# EasyEDA schematic EasyEDA.json
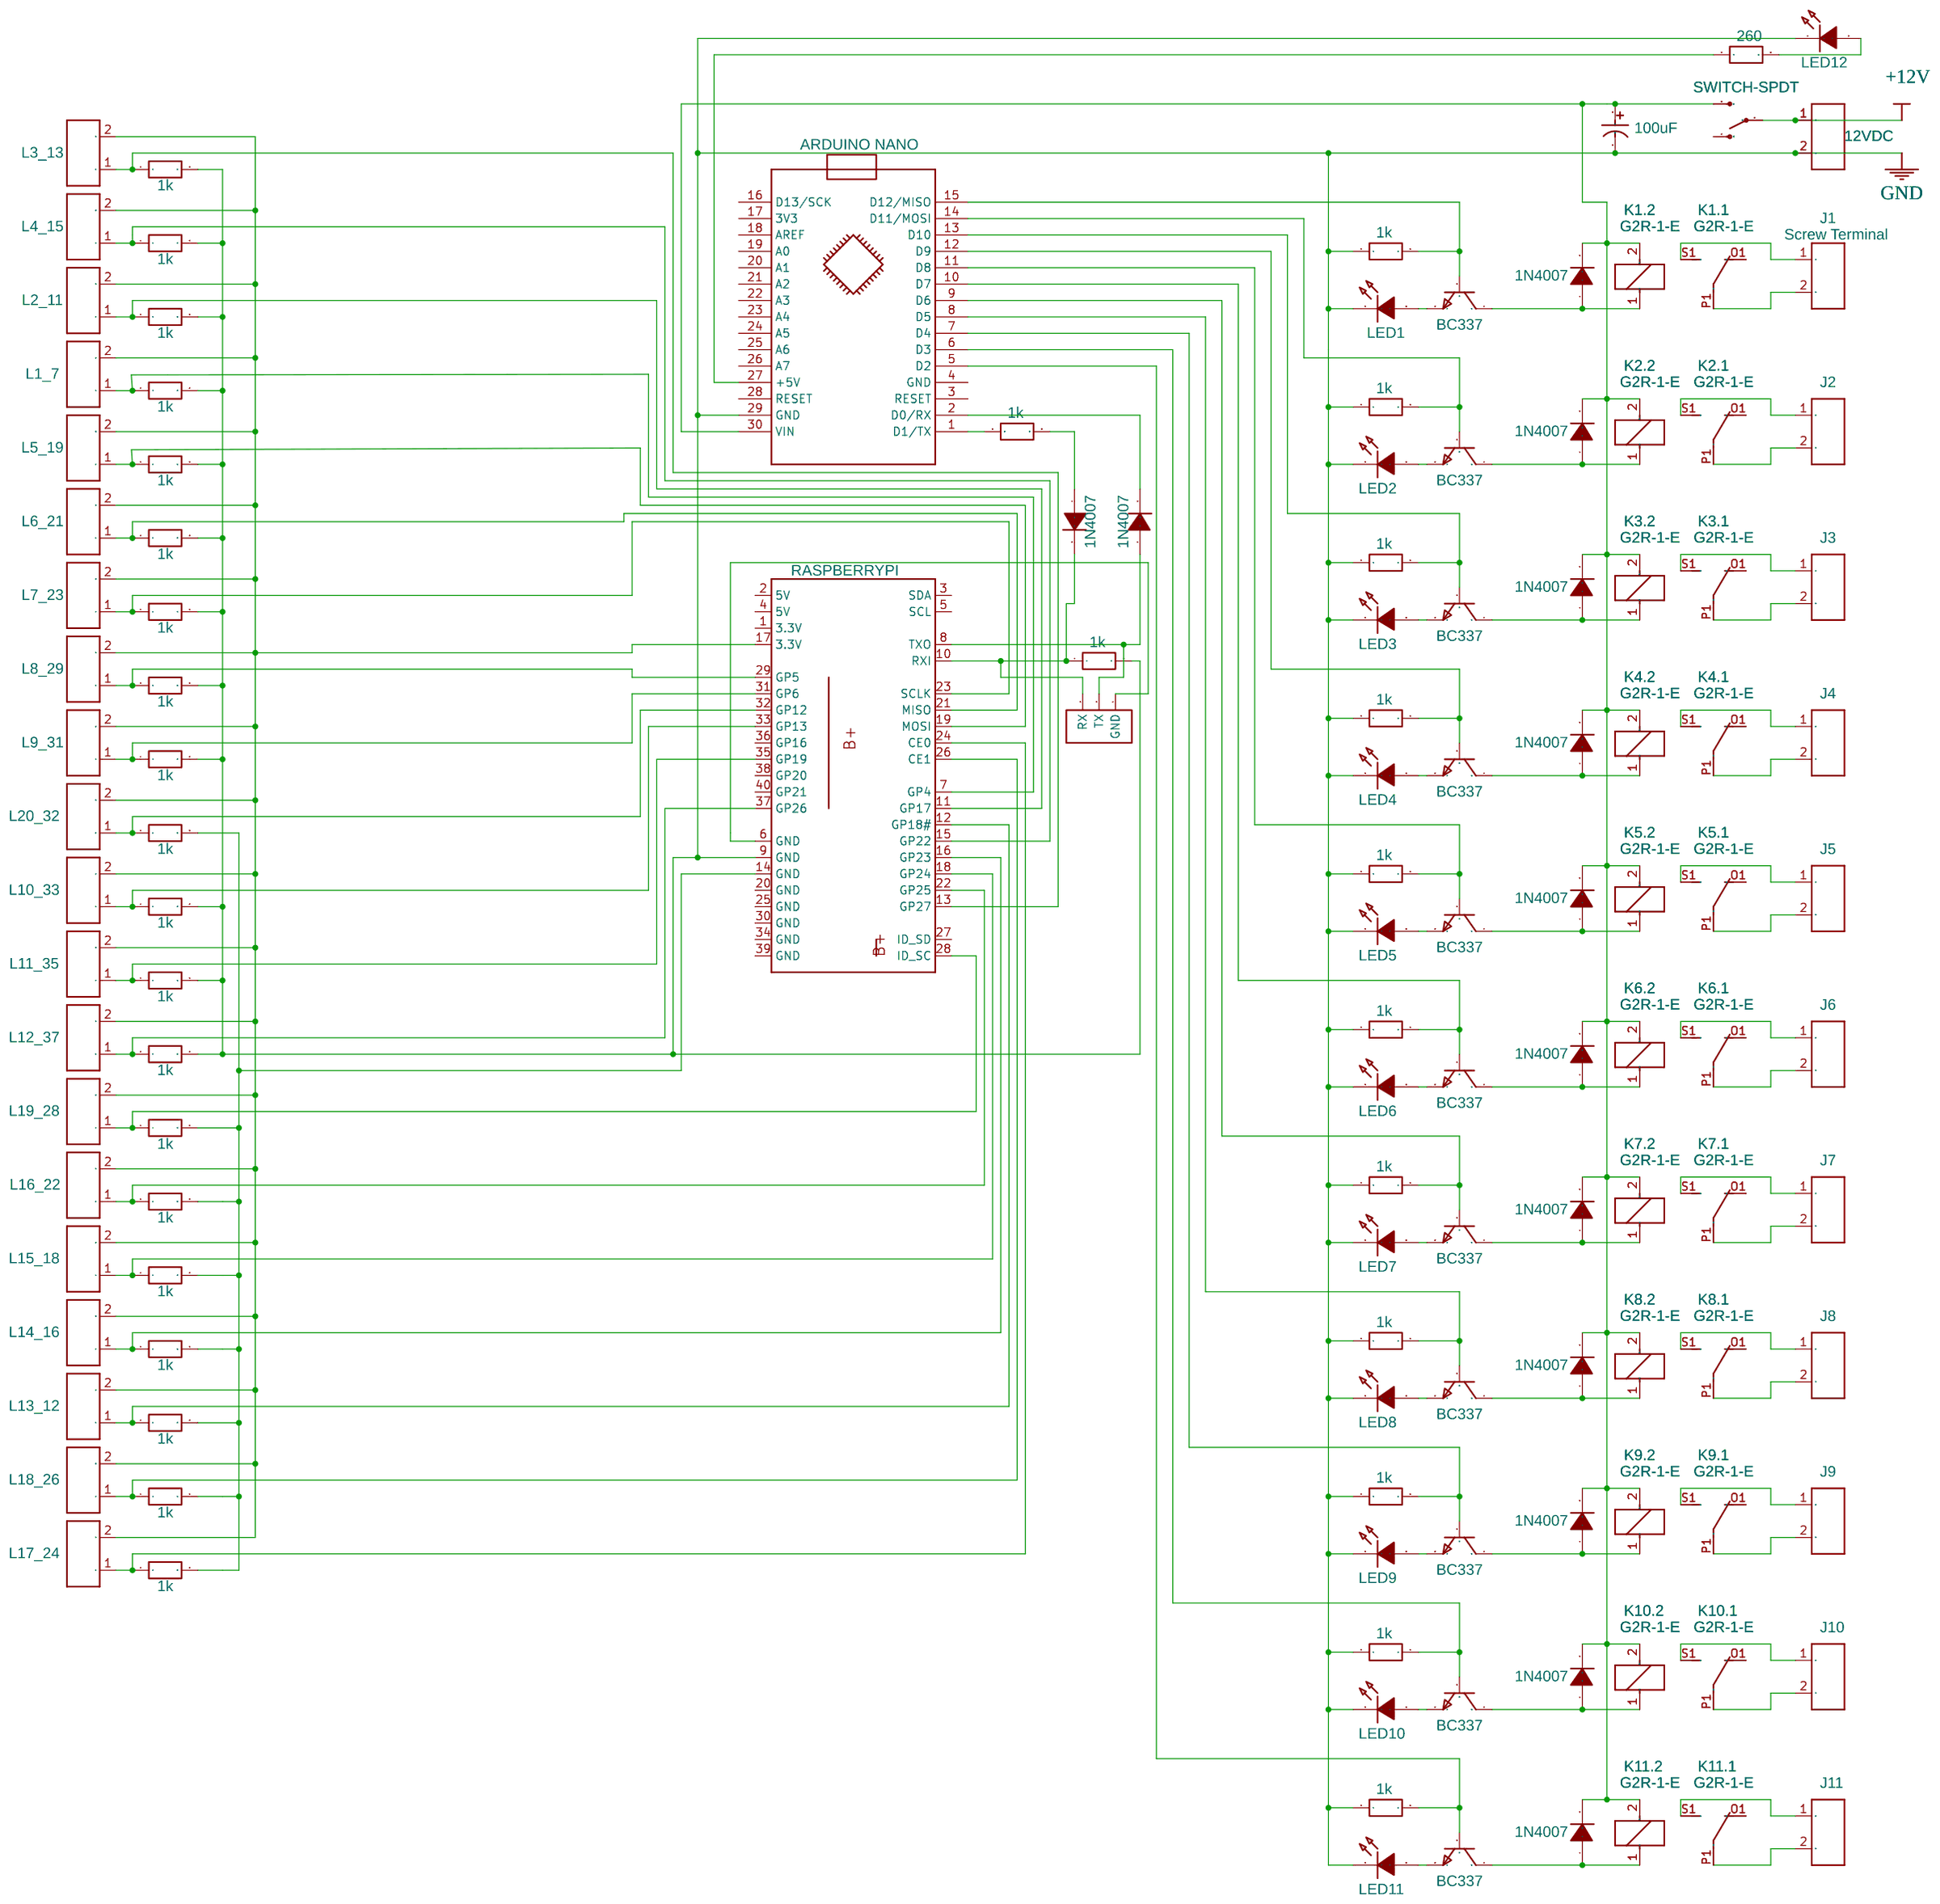
[diagram p0: schematic sheet]

## Parts
ARDU  ARDUINO NANO  [ARDUINO_NANO]
C1  100uF  [CAP-TH_BD5.0-P2.00-D0.8-FD]
D1  1N4007  [DO-41]
D2  1N4007  [DO-41]
D3  1N4007  [DO-41]
D4  1N4007  [DO-41]
D5  1N4007  [DO-41]
D6  1N4007  [DO-41]
D7  1N4007  [DO-41]
D8  1N4007  [DO-41]
D9  1N4007  [DO-41]
D10  1N4007  [DO-41]
D11  1N4007  [DO-41]
D12  1N4007  [DO-41]
D13  1N4007  [DO-41]
H1  Header Male  [HDR-TH_3P-P2.54-V]
J1  Screw Terminal  [H2-3.5-7.0X7.0MM]
J2  Screw Terminal  [H2-3.5-7.0X7.0MM]
J3  Screw Terminal  [H2-3.5-7.0X7.0MM]
J4  Screw Terminal  [H2-3.5-7.0X7.0MM]
J5  Screw Terminal  [H2-3.5-7.0X7.0MM]
J6  Screw Terminal  [H2-3.5-7.0X7.0MM]
J7  Screw Terminal  [H2-3.5-7.0X7.0MM]
J8  Screw Terminal  [H2-3.5-7.0X7.0MM]
J9  Screw Terminal  [H2-3.5-7.0X7.0MM]
J10  Screw Terminal  [H2-3.5-7.0X7.0MM]
J11  Screw Terminal  [H2-3.5-7.0X7.0MM]
J12  12VDC  [H2-3.5-7.0X7.0MM]
K1  G2R-1-E  [G2R2]  (sections 1,2)
K2  G2R-1-E  [G2R2]  (sections 1,2)
K3  G2R-1-E  [G2R2]  (sections 1,2)
K4  G2R-1-E  [G2R2]  (sections 1,2)
K5  G2R-1-E  [G2R2]  (sections 1,2)
K6  G2R-1-E  [G2R2]  (sections 1,2)
K7  G2R-1-E  [G2R2]  (sections 1,2)
K8  G2R-1-E  [G2R2]  (sections 1,2)
K9  G2R-1-E  [G2R2]  (sections 1,2)
K10  G2R-1-E  [G2R2]  (sections 1,2)
K11  G2R-1-E  [G2R2]  (sections 1,2)
L1_7  Screw Terminal  [H2-3.5-7.0X7.0MM]
L2_11  Screw Terminal  [H2-3.5-7.0X7.0MM]
L3_13  Screw Terminal  [H2-3.5-7.0X7.0MM]
L4_15  Screw Terminal  [H2-3.5-7.0X7.0MM]
L5_19  Screw Terminal  [H2-3.5-7.0X7.0MM]
L6_21  Screw Terminal  [H2-3.5-7.0X7.0MM]
L7_23  Screw Terminal  [H2-3.5-7.0X7.0MM]
L8_29  Screw Terminal  [H2-3.5-7.0X7.0MM]
L9_31  Screw Terminal  [H2-3.5-7.0X7.0MM]
L10_33  Screw Terminal  [H2-3.5-7.0X7.0MM]
L11_35  Screw Terminal  [H2-3.5-7.0X7.0MM]
L12_37  Screw Terminal  [H2-3.5-7.0X7.0MM]
L13_12  Screw Terminal  [H2-3.5-7.0X7.0MM]
L14_16  Screw Terminal  [H2-3.5-7.0X7.0MM]
L15_18  Screw Terminal  [H2-3.5-7.0X7.0MM]
L16_22  Screw Terminal  [H2-3.5-7.0X7.0MM]
L17_24  Screw Terminal  [H2-3.5-7.0X7.0MM]
L18_26  Screw Terminal  [H2-3.5-7.0X7.0MM]
L19_28  Screw Terminal  [H2-3.5-7.0X7.0MM]
L20_32  Screw Terminal  [H2-3.5-7.0X7.0MM]
LED1  LTL2T3GL4J-032A  [LED-TH_BD5.0-P2.54-L-RD]
LED2  LTL2T3GL4J-032A  [LED-TH_BD5.0-P2.54-L-RD]
LED3  LTL2T3GL4J-032A  [LED-TH_BD5.0-P2.54-L-RD]
LED4  LTL2T3GL4J-032A  [LED-TH_BD5.0-P2.54-L-RD]
LED5  LTL2T3GL4J-032A  [LED-TH_BD5.0-P2.54-L-RD]
LED6  LTL2T3GL4J-032A  [LED-TH_BD5.0-P2.54-L-RD]
LED7  LTL2T3GL4J-032A  [LED-TH_BD5.0-P2.54-L-RD]
LED8  LTL2T3GL4J-032A  [LED-TH_BD5.0-P2.54-L-RD]
LED9  LTL2T3GL4J-032A  [LED-TH_BD5.0-P2.54-L-RD]
LED10  LTL2T3GL4J-032A  [LED-TH_BD5.0-P2.54-L-RD]
LED11  LTL2T3GL4J-032A  [LED-TH_BD5.0-P2.54-L-RD]
LED12  LTL2T3GL4J-032A  [LED-TH_BD5.0-P2.54-L-RD]
Q1  BC337  [TO-92-3_L4.9-W3.7-P1.27-L]
Q2  BC337  [TO-92-3_L4.9-W3.7-P1.27-L]
Q3  BC337  [TO-92-3_L4.9-W3.7-P1.27-L]
Q4  BC337  [TO-92-3_L4.9-W3.7-P1.27-L]
Q5  BC337  [TO-92-3_L4.9-W3.7-P1.27-L]
Q6  BC337  [TO-92-3_L4.9-W3.7-P1.27-L]
Q7  BC337  [TO-92-3_L4.9-W3.7-P1.27-L]
Q8  BC337  [TO-92-3_L4.9-W3.7-P1.27-L]
Q9  BC337  [TO-92-3_L4.9-W3.7-P1.27-L]
Q10  BC337  [TO-92-3_L4.9-W3.7-P1.27-L]
Q11  BC337  [TO-92-3_L4.9-W3.7-P1.27-L]
R1  1k  [RES-TH_BD2.2-L6.5-P10.50-D0.9]
R2  1k  [RES-TH_BD2.2-L6.5-P10.50-D0.9]
R3  1k  [RES-TH_BD2.2-L6.5-P10.50-D0.9]
R4  1k  [RES-TH_BD2.2-L6.5-P10.50-D0.9]
R5  1k  [RES-TH_BD2.2-L6.5-P10.50-D0.9]
R6  1k  [RES-TH_BD2.2-L6.5-P10.50-D0.9]
R7  1k  [RES-TH_BD2.2-L6.5-P10.50-D0.9]
R8  1k  [RES-TH_BD2.2-L6.5-P10.50-D0.9]
R9  1k  [RES-TH_BD2.2-L6.5-P10.50-D0.9]
R10  1k  [RES-TH_BD2.2-L6.5-P10.50-D0.9]
R11  1k  [RES-TH_BD2.2-L6.5-P10.50-D0.9]
R12  1k  [RES-TH_BD2.2-L6.5-P10.50-D0.9]
R13  1k  [RES-TH_BD2.2-L6.5-P10.50-D0.9]
R14  260  [RES-TH_BD2.2-L6.5-P10.50-D0.9]
R101  1k  [RES-TH_BD2.2-L6.5-P10.50-D0.9]
R102  1k  [RES-TH_BD2.2-L6.5-P10.50-D0.9]
R103  1k  [RES-TH_BD2.2-L6.5-P10.50-D0.9]
R104  1k  [RES-TH_BD2.2-L6.5-P10.50-D0.9]
R105  1k  [RES-TH_BD2.2-L6.5-P10.50-D0.9]
R106  1k  [RES-TH_BD2.2-L6.5-P10.50-D0.9]
R107  1k  [RES-TH_BD2.2-L6.5-P10.50-D0.9]
R108  1k  [RES-TH_BD2.2-L6.5-P10.50-D0.9]
R109  1k  [RES-TH_BD2.2-L6.5-P10.50-D0.9]
R110  1k  [RES-TH_BD2.2-L6.5-P10.50-D0.9]
R111  1k  [RES-TH_BD2.2-L6.5-P10.50-D0.9]
R112  1k  [RES-TH_BD2.2-L6.5-P10.50-D0.9]
R113  1k  [RES-TH_BD2.2-L6.5-P10.50-D0.9]
R114  1k  [RES-TH_BD2.2-L6.5-P10.50-D0.9]
R115  1k  [RES-TH_BD2.2-L6.5-P10.50-D0.9]
R116  1k  [RES-TH_BD2.2-L6.5-P10.50-D0.9]
R117  1k  [RES-TH_BD2.2-L6.5-P10.50-D0.9]
R118  1k  [RES-TH_BD2.2-L6.5-P10.50-D0.9]
R119  1k  [RES-TH_BD2.2-L6.5-P10.50-D0.9]
R120  1k  [RES-TH_BD2.2-L6.5-P10.50-D0.9]
RPI  RASPBERRYPI  [2X20-SHROUDED]
S1  SWITCH-SPDT  [SWITCH-SPDT_LOCK.007S]

## Library data of the parts
ARDU = ARDUINO_NANO: sourceId: KGSeAWhDB
C1 = 100uf/10V: Supplier: LCSC; Manufacturer: ValuePro; Supplier Part: C2035
D1-D13 = Diode 1N 4004: Supplier: Reichelt; Supplier Part: 1N 4004; Link: https://www.reichelt.de/gleichrichterdiode-400-v-1-a-do-41-1n-4004-p1726.html?&GROUP=A4B&START=0&SORT=-rank&OFFSET=16
H1 = Header-Male-2.54_1x3: Supplier: LCSC; Manufacturer: BOOMELE; Manufacturer Part: Header2.54mm 1*3P; image: //image.lceda.cn/szlcsc/C49257.jpg; Supplier Part: C49257
J1-J12 L1_7 L2_11 L3_13 L4_15 L5_19 L6_21 L7_23 L8_29 L9_31 L10_33 L11_35 L12_37 L13_12 L14_16 L15_18 L16_22 L17_24 L18_26 L19_28 L20_32 = Screw Terminal: Manufacturer Part: ?
K1-K11 = G2R2: Contributor: Dimitri Chiminello; subpart_no: 1
LED1-LED12 = LTL2T3GL4J-032A: Supplier: LCSC; Supplier Part: C575516; Manufacturer: Lite-On; Contributor: LCSC
Q1-Q11 = BC337: Supplier Part: C154963; Supplier: LCSC; Manufacturer: CJ; Contributor: LCSC
R1-R14 R101-R120 = CFR0W4J0102A50_C66649: Supplier: LCSC; Supplier Part: C66649; Manufacturer: Uniroyal Elec; Manufacturer Part: CFR0W4J0102A50; Contributor: LCSC
RPI = RASPBERRYPI-B+-GPIO: Raspberry Pi B+ GPIO Header; Contributor: SparkFun
S1 = SWITCH-SPDT: Contributor: SparkFun

## Nets
+12V: J12.1 S1.2(P)
GND: ARDU.29(GND) C1.2 J12.2 LED1.1(-) LED2.1(-) LED3.1(-) LED4.1(-) LED5.1(-) LED6.1(-) LED7.1(-) LED8.1(-) LED9.1(-) LED10.1(-) LED11.1(-) LED12.1(-) R1.1 R2.1 R3.1 R4.1 R5.1 R6.1 R7.1 R8.1 R9.1 R10.1 R11.1 R12.2 R101.2 R102.2 R103.2 R104.2 R105.2 R106.2 R107.2 R108.2 R109.2 R110.2 R111.2 R112.2 RPI.9(GND)
Net-(ARDU-1): ARDU.1(D1/TX) R13.1
Net-(ARDU-2): ARDU.2(D0/RX) D13.2(K)
Net-(ARDU-5): ARDU.5(D2) Q11.2(B) R11.2
Net-(ARDU-6): ARDU.6(D3) Q10.2(B) R10.2
Net-(ARDU-7): ARDU.7(D4) Q9.2(B) R9.2
Net-(ARDU-8): ARDU.8(D5) Q8.2(B) R8.2
Net-(ARDU-9): ARDU.9(D6) Q7.2(B) R7.2
Net-(ARDU-10): ARDU.10(D7) Q6.2(B) R6.2
Net-(ARDU-11): ARDU.11(D8) Q5.2(B) R5.2
Net-(ARDU-12): ARDU.12(D9) Q4.2(B) R4.2
Net-(ARDU-13): ARDU.13(D10) Q3.2(B) R3.2
Net-(ARDU-14): ARDU.14(D11/MOSI) Q2.2(B) R2.2
Net-(ARDU-15): ARDU.15(D12/MISO) Q1.2(B) R1.2
Net-(ARDU-27): ARDU.27(+5V) R14.1
Net-(ARDU-30): ARDU.30(VIN) C1.1 D1.2(K) D2.2(K) D3.2(K) D4.2(K) D5.2(K) D6.2(K) D7.2(K) D8.2(K) D9.2(K) D10.2(K) D11.2(K) K1.2 K2.2 K3.2 K4.2 K5.2 K6.2 K7.2 K8.2 K9.2 K10.2 K11.2 S1.3(S)
Net-(D1-1): D1.1(A) K1.1 Q1.1(C)
Net-(D2-1): D2.1(A) K2.1 Q2.1(C)
Net-(D3-1): D3.1(A) K3.1 Q3.1(C)
Net-(D4-1): D4.1(A) K4.1 Q4.1(C)
Net-(D5-1): D5.1(A) K5.1 Q5.1(C)
Net-(D6-1): D6.1(A) K6.1 Q6.1(C)
Net-(D7-1): D7.1(A) K7.1 Q7.1(C)
Net-(D8-1): D8.1(A) K8.1 Q8.1(C)
Net-(D9-1): D9.1(A) K9.1 Q9.1(C)
Net-(D10-1): D10.1(A) K10.1 Q10.1(C)
Net-(D11-1): D11.1(A) K11.1 Q11.1(C)
Net-(D12-1): D12.1(A) R13.2
Net-(D12-2): D12.2(K) H1.3(RX) R12.1 RPI.10(RXI)
Net-(D13-1): D13.1(A) H1.2(TX) RPI.8(TXO)
Net-(H1-1): H1.1(GND) RPI.6(GND)
Net-(J1-1): J1.1 K1.S1(S)
Net-(J1-2): J1.2 K1.P1(P)
Net-(J2-1): J2.1 K2.S1(S)
Net-(J2-2): J2.2 K2.P1(P)
Net-(J3-1): J3.1 K3.S1(S)
Net-(J3-2): J3.2 K3.P1(P)
Net-(J4-1): J4.1 K4.S1(S)
Net-(J4-2): J4.2 K4.P1(P)
Net-(J5-1): J5.1 K5.S1(S)
Net-(J5-2): J5.2 K5.P1(P)
Net-(J6-1): J6.1 K6.S1(S)
Net-(J6-2): J6.2 K6.P1(P)
Net-(J7-1): J7.1 K7.S1(S)
Net-(J7-2): J7.2 K7.P1(P)
Net-(J8-1): J8.1 K8.S1(S)
Net-(J8-2): J8.2 K8.P1(P)
Net-(J9-1): J9.1 K9.S1(S)
Net-(J9-2): J9.2 K9.P1(P)
Net-(J10-1): J10.1 K10.S1(S)
Net-(J10-2): J10.2 K10.P1(P)
Net-(J11-1): J11.1 K11.S1(S)
Net-(J11-2): J11.2 K11.P1(P)
Net-(L1_7-1): L1_7.1 R101.1 RPI.7(GP4)
Net-(L1_7-2): L1_7.2 L2_11.2 L3_13.2 L4_15.2 L5_19.2 L6_21.2 L7_23.2 L8_29.2 L9_31.2 L10_33.2 L11_35.2 L12_37.2 L13_12.2 L14_16.2 L15_18.2 L16_22.2 L17_24.2 L18_26.2 L19_28.2 L20_32.2 RPI.17(3.3V)
Net-(L2_11-1): L2_11.1 R102.1 RPI.11(GP17)
Net-(L3_13-1): L3_13.1 R103.1 RPI.13(GP27)
Net-(L4_15-1): L4_15.1 R104.1 RPI.15(GP22)
Net-(L5_19-1): L5_19.1 R105.1 RPI.19(MOSI)
Net-(L6_21-1): L6_21.1 R106.1 RPI.21(MISO)
Net-(L7_23-1): L7_23.1 R107.1 RPI.23(SCLK)
Net-(L8_29-1): L8_29.1 R108.1 RPI.29(GP5)
Net-(L9_31-1): L9_31.1 R109.1 RPI.31(GP6)
Net-(L10_33-1): L10_33.1 R110.1 RPI.33(GP13)
Net-(L11_35-1): L11_35.1 R111.1 RPI.35(GP19)
Net-(L12_37-1): L12_37.1 R112.1 RPI.37(GP26)
Net-(L13_12-1): L13_12.1 R113.1 RPI.12(GP18#)
Net-(L14_16-1): L14_16.1 R114.1 RPI.16(GP23)
Net-(L15_18-1): L15_18.1 R115.1 RPI.18(GP24)
Net-(L16_22-1): L16_22.1 R116.1 RPI.22(GP25)
Net-(L17_24-1): L17_24.1 R117.1 RPI.24(CE0)
Net-(L18_26-1): L18_26.1 R118.1 RPI.26(CE1)
Net-(L19_28-1): L19_28.1 R119.1 RPI.28(ID_SC)
Net-(L20_32-1): L20_32.1 R120.1 RPI.32(GP12)
Net-(LED1-2): LED1.2(+) Q1.3(E)
Net-(LED2-2): LED2.2(+) Q2.3(E)
Net-(LED3-2): LED3.2(+) Q3.3(E)
Net-(LED4-2): LED4.2(+) Q4.3(E)
Net-(LED5-2): LED5.2(+) Q5.3(E)
Net-(LED6-2): LED6.2(+) Q6.3(E)
Net-(LED7-2): LED7.2(+) Q7.3(E)
Net-(LED8-2): LED8.2(+) Q8.3(E)
Net-(LED9-2): LED9.2(+) Q9.3(E)
Net-(LED10-2): LED10.2(+) Q10.3(E)
Net-(LED11-2): LED11.2(+) Q11.3(E)
Net-(LED12-2): LED12.2(+) R14.2
Net-(R113-2): R113.2 R114.2 R115.2 R116.2 R117.2 R118.2 R119.2 R120.2 RPI.14(GND)

Not connected (* = marked no-connect by the designer): ARDU 3(RESET) 4(GND) 16(D13/SCK) 17(3V3) 18(AREF) 19(A0) 20(A1) 21(A2) 22(A3) 23(A4) 24(A5) 25(A6) 26(A7) 28(RESET); K1 O1(O); K2 O1(O); K3 O1(O); K4 O1(O); K5 O1(O); K6 O1(O); K7 O1(O); K8 O1(O); K9 O1(O); K10 O1(O); K11 O1(O); RPI 1(3.3V) 2(5V) 3(SDA) 4(5V) 5(SCL) 20(GND) 25(GND) 27(ID_SD) 30(GND) 34(GND) 36(GP16) 38(GP20) 39(GND) 40(GP21); S1 1(O)
